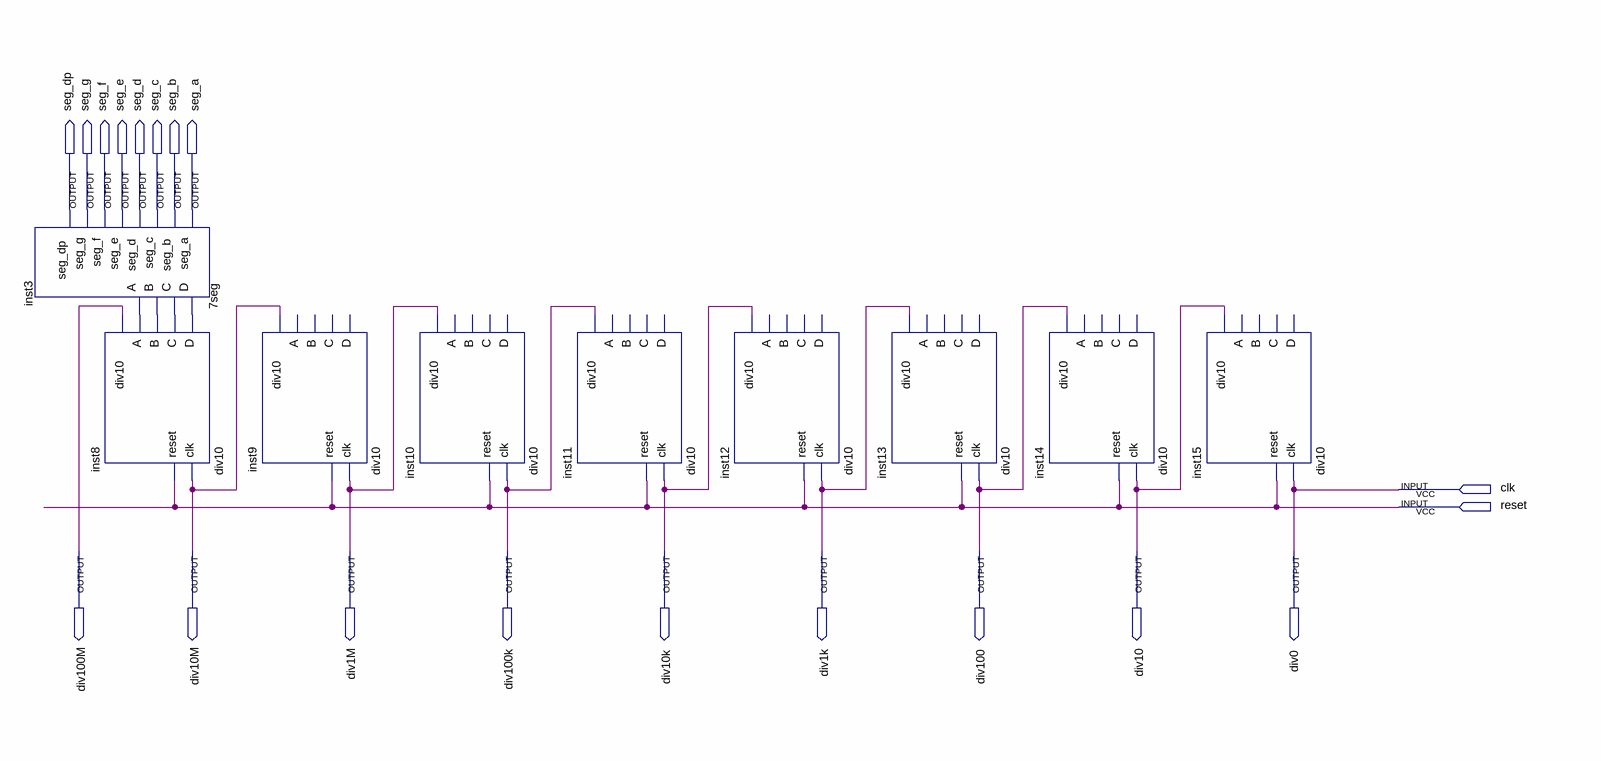
[diagram p0: schematic sheet]
// Quartus schematic clock7segs.bdf as structural Verilog: 9 symbols, 19 pins
module clock7segs (
  input  clk,
  input  reset,
  output seg_dp,
  output seg_g,
  output seg_f,
  output seg_e,
  output seg_d,
  output seg_c,
  output seg_b,
  output seg_a,
  output div100M,
  output div10M,
  output div1M,
  output div100k,
  output div10k,
  output div1k,
  output div100,
  output div10,
  output div0
);

  wire inst8_a, inst8_b, inst8_c, inst8_d;

  \7seg  inst3 (
    .D(inst8_d), .C(inst8_c), .B(inst8_b), .A(inst8_a), .seg_a(seg_a), .seg_b(seg_b), .seg_c(seg_c),
    .seg_d(seg_d), .seg_e(seg_e), .seg_f(seg_f), .seg_g(seg_g), .seg_dp(seg_dp));
  div10 inst8 (.clk(div10M), .reset(reset), .D(inst8_d), .C(inst8_c), .B(inst8_b), .A(inst8_a), .div10(div100M));
  div10 inst9 (.clk(div1M), .reset(reset), .div10(div10M));  // open: D, C, B, A
  div10 inst10 (.clk(div100k), .reset(reset), .div10(div1M));  // open: D, C, B, A
  div10 inst11 (.clk(div10k), .reset(reset), .div10(div100k));  // open: D, C, B, A
  div10 inst12 (.clk(div1k), .reset(reset), .div10(div10k));  // open: D, C, B, A
  div10 inst13 (.clk(div100), .reset(reset), .div10(div1k));  // open: D, C, B, A
  div10 inst14 (.clk(div10), .reset(reset), .div10(div100));  // open: D, C, B, A
  div10 inst15 (.clk(clk), .reset(reset), .div10(div10));  // open: D, C, B, A

  assign div0 = clk;
endmodule
